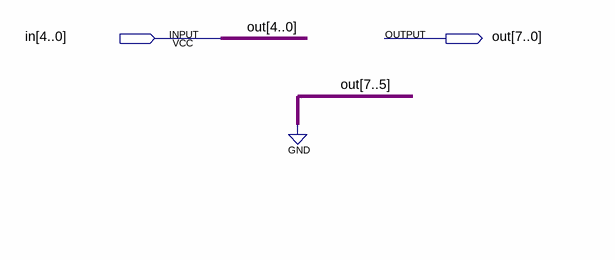
[diagram p0: schematic sheet]
// Quartus schematic bus_4i8o.bdf as structural Verilog: 0 symbols, 2 pins
module bus_4i8o (
  input  [4:0] in,
  output [7:0] out
);


  assign out = {3'b000, in};
endmodule
